# EAGLE design 2016 Vehicle Pedal and Dash Controller manufactured 2016-11-07 (EAGLE 7.7.0)
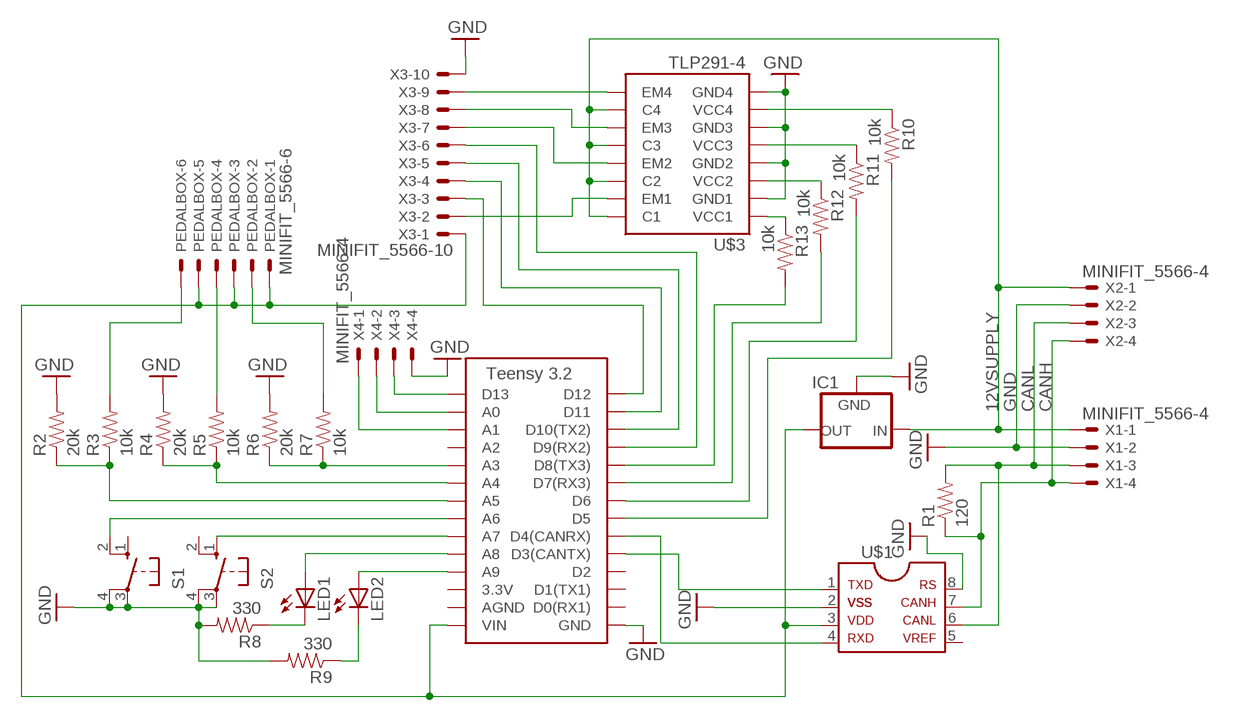
[diagram p0: schematic, sheet 1]

## Parts
IC1  5V_REGULATOR_LM340-NLM340MPX-5.0/NOPB  [SOT223]
LED1  LED-0805  [LED-805]
LED2  LED-0805  [LED-805]
PEDALBOX  MINIFIT_5566-6  [MINIFIT_5566-6]
R1  120  RESISTOR0805-RES  [0805]
R2  20k  RESISTOR0805-RES  [0805]
R3  10k  RESISTOR0805-RES  [0805]
R4  20k  RESISTOR0805-RES  [0805]
R5  10k  RESISTOR0805-RES  [0805]
R6  20k  RESISTOR0805-RES  [0805]
R7  10k  RESISTOR0805-RES  [0805]
R8  330  RESISTOR0805-RES  [0805]
R9  330  RESISTOR0805-RES  [0805]
R10  10k  RESISTOR0805-RES  [0805]
R11  10k  RESISTOR0805-RES  [0805]
R12  10k  RESISTOR0805-RES  [0805]
R13  10k  RESISTOR0805-RES  [0805]
S1  BTN_10-XX  [B3F-10XX]
S2  BTN_10-XX  [B3F-10XX]
U$1  MCP2551DIL  [DIL08]
U$2  TEENSY_3.2_SIMPLE  [TEENSY_3.2_SIMPLE]
U$3  TLP291-4  [SOIC-16]
X1  MINIFIT_5566-4  [MINIFIT_5566-4]
X2  MINIFIT_5566-4  [MINIFIT_5566-4]
X3  MINIFIT_5566-10  [MINIFIT_5566-10]
X4  MINIFIT_5566-4  [MINIFIT_5566-4]

## Nets
12VSUPPLY: IC1.1(IN) U$3.10(C4) U$3.12(C3) U$3.14(C2) U$3.16(C1) X1.1 X2.1
CANH: R1.1 U$1.7 X1.4 X2.4
CANL: R1.2 U$1.6 X1.3 X2.3
GND: IC1.2(GND) IC1.4(GND) R2.2 R4.2 R6.2 R8.2 R9.2 S1.3(P) S1.4(P1) S2.3(P) S2.4(P1) U$1.2 U$1.8 U$2.GND U$3.2(GND1) U$3.4(GND2) U$3.6(GND3) U$3.8(GND4) X1.2 X2.2 X3.10 X4.4
N$1: U$2.D12 X3.3
N$2: IC1.3(OUT) PEDALBOX.1 PEDALBOX.3 PEDALBOX.5 U$1.3 U$2.VIN X3.1
N$3: PEDALBOX.6 R3.2
N$4: PEDALBOX.4 R5.2
N$5: U$1.1 U$2.D3(CANTX)
N$6: U$1.4 U$2.D4(CANRX)
N$7: PEDALBOX.2 R7.2
N$8: R2.1 R3.1 U$2.A5
N$9: R4.1 R5.1 U$2.A4
N$10: R6.1 R7.1 U$2.A3
N$11: U$2.D11 X3.4
N$12: U$2.D10(TX2) X3.5
N$13: U$2.D9(RX2) X3.6
N$14: R13.2 U$2.D8(TX3)
N$15: U$3.9(EM4) X3.9
N$16: U$3.11(EM3) X3.8
N$17: U$3.13(EM2) X3.7
N$18: U$3.15(EM1) X3.2
N$19: R12.2 U$2.D7(RX3)
N$20: R11.2 U$2.D6
N$21: R10.2 U$2.D5
N$22: S1.2(S1) U$2.A6
N$23: S2.1(S) U$2.A7
N$24: LED1.A U$2.A8
N$25: LED2.A U$2.A9
N$26: LED1.C R8.1
N$27: LED2.C R9.1
N$28: U$2.D13 X4.3
N$29: U$2.A0 X4.2
N$30: U$2.A1 X4.1
N$31: R11.1 U$3.5(VCC3)
N$32: R12.1 U$3.3(VCC2)
N$33: R13.1 U$3.1(VCC1)
N$34: R10.1 U$3.7(VCC4)
Unconnected: S1.1(S) S2.2(S1) U$1.5 U$2.3.3V U$2.A2 U$2.AGND U$2.D0(RX1) U$2.D1(TX1) U$2.D2

## Library data of the parts
IC1 = HyTechDevices:5V_REGULATOR_LM340-N: Voltage Regulator 5v linear voltage regulator Datasheet <http://www.mouser.com/ProductDetail/Texas-Instruments/LM340MPX-50-NOPB/?qs=X1J7HmVL2ZGZwtTFRQ9ItA%3D%3D> MAX current out: 1.5A MAX voltage in: 35V
LED1 LED2 = HyTechDevices:LED: Light Emitting Diode Source: Dangerous Prototypes Eagle Library <https://github.com/DangerousPrototypes/Eagle_Part_Library>
PEDALBOX = HyTechDevices:MINIFIT_5566-6: Mini FIT Junior connector 6 pole Source: http://www.molex.com; MPN: 95566-61002; OC_FARNELL: unknown; OC_NEWARK: 22K8620
R1-R13 = HyTechDevices:RESISTOR: Resistor Basic schematic elements and footprints for 0603, 1206, and PTH resistors.
S1 S2 = HyTechDevices:BTN_10-XX: OMRON SWITCH; MPN: B3F-1000; OC_FARNELL: 176432; OC_NEWARK: 36M3542
U$1 = HyTechDevices:MCP2551: MCP2551 High-Speed CAN Transceiver Product Webpage <https://www.microchip.com/wwwproducts/en/MCP2551> Datasheet <http://ww1.microchip.com/downloads/en/DeviceDoc/21667f.pdf> This device is outdated It is replaced by MCP2561. Comparison Page <https://www.microchip.com/wwwproducts/ProductCompare/MCP2551/MCP2561> Product Webpage <https://www.microchip.com/wwwproducts/en/MCP2561> Datasheet <http://ww1.microchip.com/downloads/en/DeviceDoc/20005167C.pdf>
U$2 = HyTechDevices:TEENSY_3.2_SIMPLE: Simple version of the Teensy 3.2 board that only uses the 2 main rows of pins, not the inner pins or the pins opposite the usb port.
U$3 = HyTechDevices:TLP291-4: Toshiba Quad Channel Optocoupler TLP291-4
X1 X2 X4 = HyTechDevices:MINIFIT_5566-4: Mini FIT Junior connector 4 pole Source: http://www.molex.com; OC_FARNELL: unknown; OC_NEWARK: unknown
X3 = HyTechDevices:MINIFIT_5566-10: Mini FIT Junior connector 10 pole Source: http://www.molex.com; OC_FARNELL: unknown; OC_NEWARK: unknown

## Board
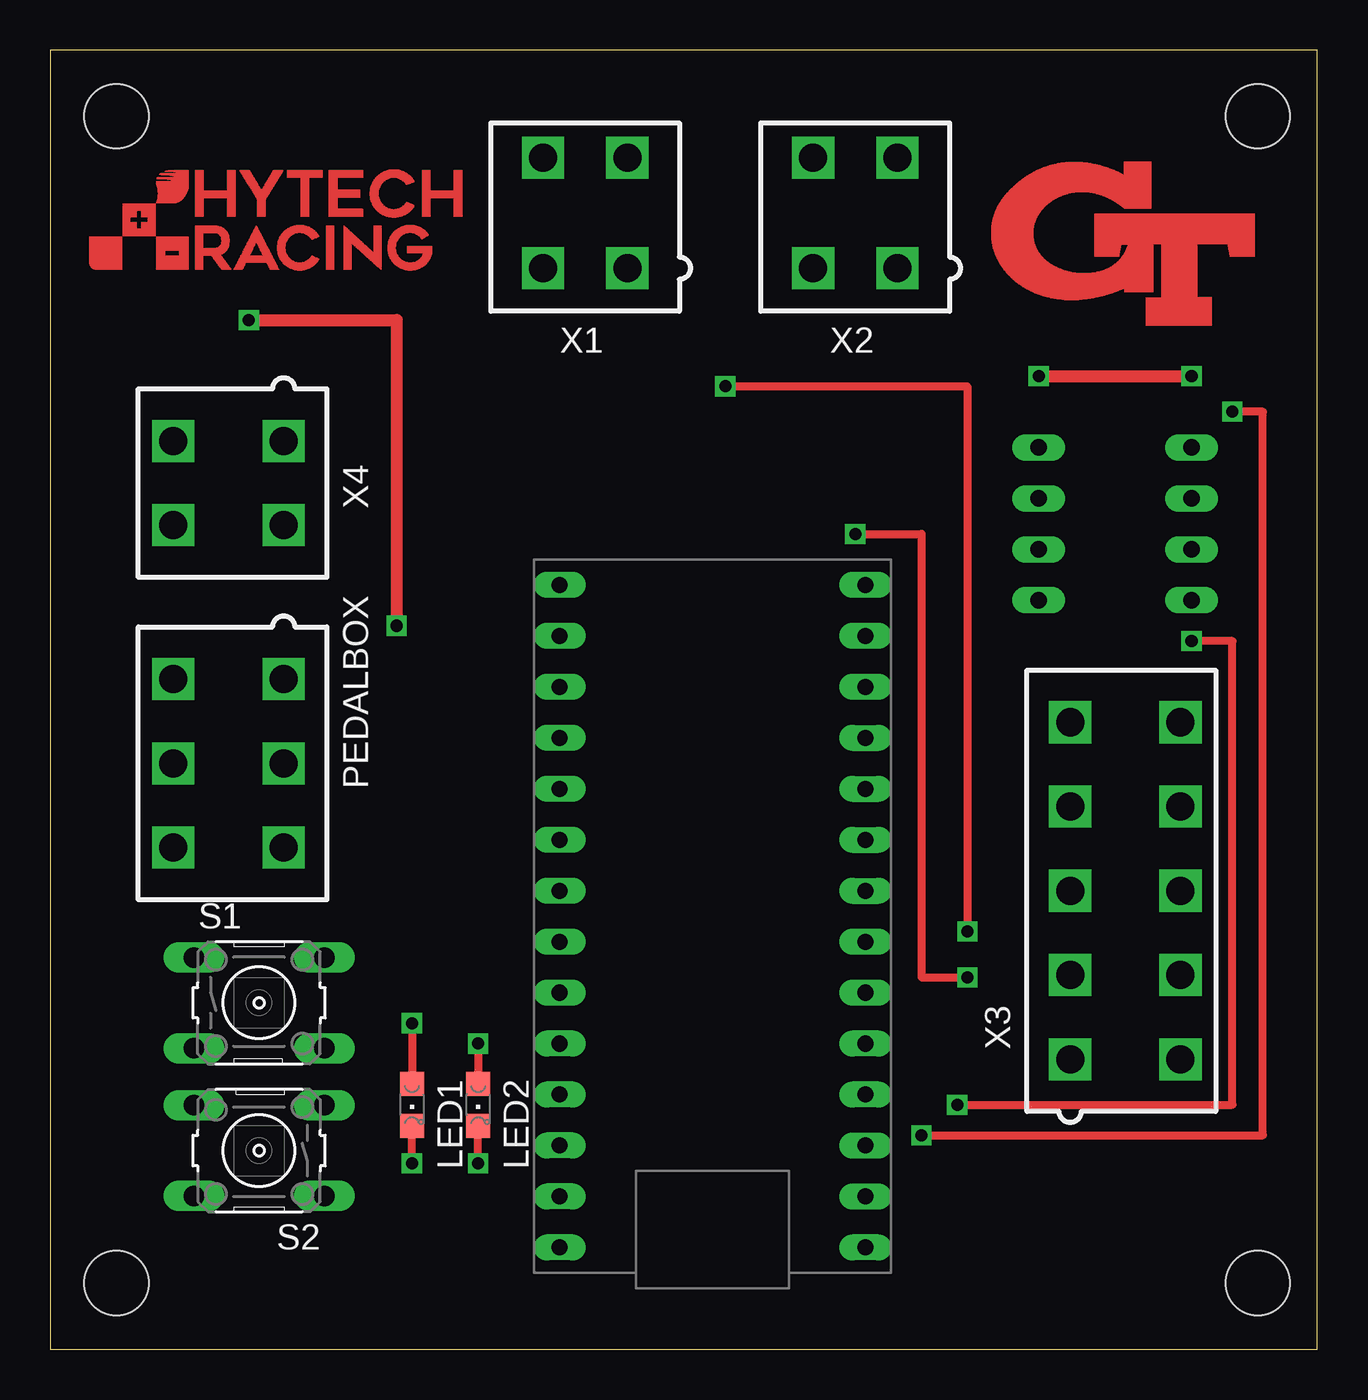
[diagram p1: board, top side]
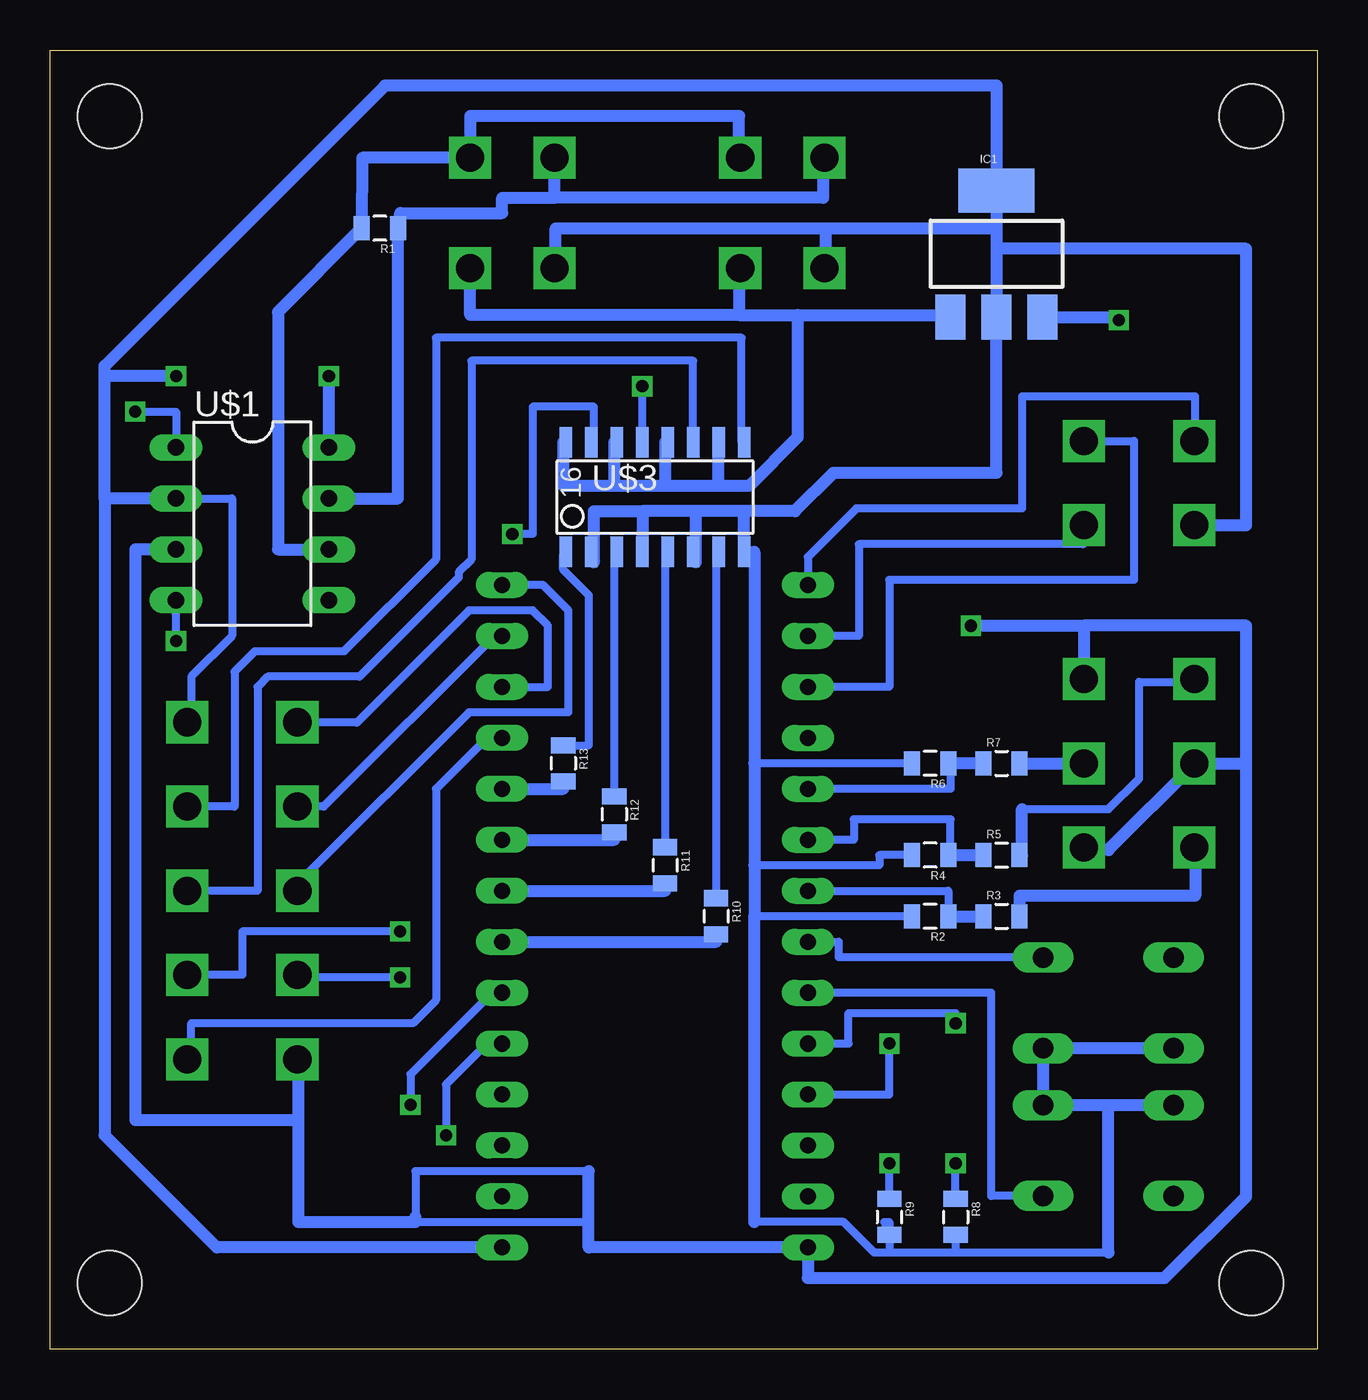
[diagram p2: board, bottom side, seen from below]

Size 63.17 x 64.76 mm. Coordinates in mm from the lower left corner, seen from the top.
Outline: 0,0 63.17,0 63.17,64.76 0,64.76 0,0
Copper layers (1*16): Top 0.035mm / dielectric 1.5mm / Bottom 0.035mm
Design rules "default": minimum track width 10mil, minimum drill 24mil, track to track 8mil, track to pad 8mil, pad to pad 8mil, via to via 8mil, smd to smd 8mil, copper to edge 40mil, drill to drill 8mil, minimum pad ring 10mil, minimum via ring 8mil, stop-mask expansion 4mil, vias tented up to drill 0mil, thermal gap 10mil
Holes 3.2 mm at 3.3,61.47 60.2,61.47 60.2,3.3 3.3,3.3

### Footprints (pad centres in the part's own frame; a part is rotated, then mirrored left to right if it is on the bottom)
SOT223 = smd 1.5 x 2.235: 1 -2.3,-3.15; 2 0,-3.15; 3 2.3,-3.15 | smd 3.8 x 2.2: 4 0,3.15
LED-805 = smd 1.2 x 1.2: A 0,-1.05; C 0,1.05
MINIFIT_5566-6 = drill 1.4 square: 1 4.2,-2.75; 2 0,-2.75; 3 -4.2,-2.75; 4 4.2,2.75; 5 0,2.75; 6 -4.2,2.75
0805 = smd 0.8 x 1.2: 1 -0.9,0; 2 0.9,0
B3F-10XX = drill 1.016 long: 1 -3.251,2.261; 2 3.251,2.261; 3 -3.251,-2.261; 4 3.251,-2.261
DIL08 = drill 0.813 long: 1 -3.81,-3.81; 2 -1.27,-3.81; 3 1.27,-3.81; 4 3.81,-3.81; 5 3.81,3.81; 6 1.27,3.81; 7 -1.27,3.81; 8 -3.81,3.81
TEENSY_3.2_SIMPLE = drill 0.8 long: 3.3V 16.51,29.21; A0 16.51,3.81; A1 16.51,6.35; A2 16.51,8.89; A3 16.51,11.43; A4 16.51,13.97; A5 16.51,16.51; A6 16.51,19.05; A7 16.51,21.59; A8 16.51,24.13; A9 16.51,26.67; AGND 16.51,31.75; D0(RX1) 1.27,31.75; D1(TX1) 1.27,29.21; D2 1.27,26.67; D3(CANTX) 1.27,24.13; D4(CANRX) 1.27,21.59; D5 1.27,19.05; D6 1.27,16.51; D7(RX3) 1.27,13.97; D8(TX3) 1.27,11.43; D9(RX2) 1.27,8.89; D10(TX2) 1.27,6.35; D11 1.27,3.81; D12 1.27,1.27; D13 16.51,1.27; GND 1.27,34.29; VIN 16.51,34.29
SOIC-16 = smd 0.61 x 1.524: 1 -4.445,-2.794; 2 -3.175,-2.794; 3 -1.905,-2.794; 4 -0.635,-2.794; 5 0.635,-2.794; 6 1.905,-2.794; 7 3.175,-2.794; 8 4.445,-2.794; 9 4.445,2.667; 10 3.175,2.667; 11 1.905,2.667; 12 0.635,2.667; 13 -0.635,2.667; 14 -1.905,2.667; 15 -3.175,2.667; 16 -4.445,2.667
MINIFIT_5566-4 = drill 1.4 square: 1 2.1,-2.75; 2 -2.1,-2.75; 3 2.1,2.75; 4 -2.1,2.75
MINIFIT_5566-10 = drill 1.4 square: 1 8.4,-2.75; 2 4.2,-2.75; 3 0,-2.75; 4 -4.2,-2.75; 5 -8.4,-2.75; 6 8.4,2.75; 7 4.2,2.75; 8 0,2.75; 9 -4.2,2.75; 10 -8.4,2.75

### Placement (x,y rotation side)
IC1  16,54.61 0 bottom
LED1  18.03,12.19 180 top
LED2  21.34,12.19 180 top
PEDALBOX  8.89,29.21 90 top
R1  46.74,55.88 180 bottom
R2  19.3,21.59 180 bottom
R3  15.75,21.59 0 bottom
R4  19.3,24.64 180 bottom
R5  15.75,24.64 0 bottom
R6  19.3,29.21 180 bottom
R7  15.75,29.21 0 bottom
R8  18.03,6.6 270 bottom
R9  21.34,6.6 270 bottom
R10  29.97,21.59 270 bottom
R11  32.51,24.13 270 bottom
R12  35.05,26.67 270 bottom
R13  37.59,29.21 270 bottom
S1  10.41,17.27 0 top
S2  10.41,9.91 180 top
U$1  53.09,41.15 270 bottom
U$2  41.91,39.37 180 top
U$3  33.02,42.55 0 bottom
X1  26.67,56.64 0 top
X2  40.13,56.64 0 top
X3  53.59,22.86 270 top
X4  8.89,43.18 90 top

### Tracks (layer width: path | path; a pad name or v marks a point on that pad's centre or on a via)
12VSUPPLY
  Bottom 0.61: X1.1 28.83,53.89 28.83,51.56 | 28.83,51.56 42.23,51.56 X2.1 | 28.83,51.56 25.91,51.56 | 25.91,51.56 25.91,45.47 28.32,43.05 29.85,43.05 | 29.85,43.05 U$3.10 | U$3.12 32.51,45.21 32.51,43.05 | 32.51,43.05 29.85,43.05 | U$3.14 35.05,45.21 35.05,43.05 | 35.05,43.05 32.51,43.05 | U$3.16 37.59,45.21 37.59,43.05 35.05,43.05 | 25.91,51.56 18.3,51.56 IC1.1
CANH
  Bottom 0.61: X1.4 24.64,59.39 24.64,57.4 38.03,57.4 | 38.03,57.4 X2.4 | 38.03,57.4 40.64,57.4 40.64,56.64 45.72,56.64 45.72,55.88 R1.1 45.84,42.42 U$1.7
CANL
  Bottom 0.61: X1.3 28.83,59.39 28.83,61.47 42.23,61.47 X2.3 47.61,59.39 R1.2 51.82,51.7 51.82,39.88 U$1.6
GND  (via drill 0.6)
  Top 0.61: v49.28,48.51 v56.9,48.51
  Bottom 0.406: R6.2 28.07,29.21 | R4.2 21.84,24.64 21.84,24.13 28.07,24.13 | R2.2 28.07,21.59 | R9.2 21.59,6.35 21.34,6.35 R9.2 | 21.34,4.83 22.1,4.83 23.62,6.35 28.07,6.35 | 21.34,4.83 18.03,4.83 | 18.03,4.83 10.41,4.83 | R8.2 18.03,4.83 | R9.2 21.34,4.83 | U$1.2 54.1,42.42 54.1,35.56 56.13,33.53 56.13,31.47 X3.10
  Bottom 0.61: U$3.2 36.07,39.24 36.07,41.78 33.65,41.78 | 33.65,41.78 U$3.4 | U$3.6 30.99,39.24 30.99,41.78 | 30.99,41.78 33.65,41.78 | 28.57,41.78 U$3.8 28.07,39.75 28.07,29.21 28.07,24.13 28.07,21.59 28.07,6.35 | 28.57,41.78 30.99,41.78 | 16,55.88 IC1.4 16,62.99 46.48,62.99 60.45,49.02 60.45,48.51 | 16,55.88 16,54.86 | 16,54.86 IC1.2 16,43.69 24.13,43.69 26.04,41.78 28.57,41.78 | X1.2 24.51,53.89 24.51,55.88 | X4.4 3.56,41.08 3.56,54.86 16,54.86 | X2.2 37.97,53.89 37.97,55.88 24.51,55.88 | S2.4 10.41,12.17 | 10.41,12.17 S2.3 S1.4 S1.3 | U$1.2 60.45,42.42 | 60.45,42.42 60.45,48.51 | U$1.8 v49.28,48.51 | 10.41,4.83 10.41,12.17 | U$2.GND 54.86,5.08 60.45,10.67 60.45,42.42 | 24.51,55.88 16,55.88 | v56.9,48.51 60.45,48.51
N$1
  Bottom 0.406: U$2.D12 38.61,38.1 37.34,36.83 37.34,31.75 42.29,31.75 50.67,23.37 50.67,23.03 X3.3
N$2  (via drill 0.6)
  Top 0.61: v9.91,51.31 17.27,51.31 v17.27,36.07
  Bottom 0.406: 44.96,6.35 36.32,6.35 | 44.96,6.6 44.96,8.89 36.32,8.89
  Bottom 0.61: X3.1 50.8,14.46 50.8,11.43 | 50.8,11.43 50.8,6.35 44.96,6.35 44.96,6.6 | IC1.3 9.91,51.46 v9.91,51.31 | v17.27,36.07 11.64,36.07 | 11.64,36.07 PEDALBOX.1 | 3.56,29.21 PEDALBOX.5 6.14,29.17 10.41,24.89 11.52,24.89 PEDALBOX.3 | 3.56,29.21 3.56,36.07 11.64,36.07 | U$1.3 58.93,39.88 58.93,11.43 50.8,11.43 | 3.56,29.21 3.56,7.62 7.62,3.56 25.4,3.56 U$2.VIN 36.32,5.08 36.32,8.89
N$3
  Bottom 0.61: PEDALBOX.6 6.1,25.01 6.1,22.61 14.85,22.61 R3.2
N$4
  Bottom 0.406: 14.73,26.92 10.41,26.92 8.89,28.45 8.89,33.27 6.28,33.27 PEDALBOX.4
  Bottom 0.61: R5.2 14.73,24.64 14.73,26.92
N$5  (via drill 0.6)
  Top 0.406: v43.43,10.67 60.45,10.67 60.45,46.74 v58.93,46.74
  Bottom 0.406: U$2.D3(CANTX) 41.4,15.24 43.43,13.21 v43.43,10.67 | v58.93,46.74 56.9,46.74 U$1.1
N$6  (via drill 0.6)
  Top 0.406: v45.21,12.19 58.93,12.19 58.93,35.31 v56.9,35.31
  Bottom 0.406: U$2.D4(CANRX) 41.15,17.78 45.21,13.72 v45.21,12.19 | v56.9,35.31 U$1.4
N$7
  Bottom 0.61: R7.2 PEDALBOX.2
N$8
  Bottom 0.406: U$2.A5 18.4,22.86 R2.1
  Bottom 0.61: R2.1 R3.1
N$9
  Bottom 0.406: R4.1 18.29,24.64 18.29,26.42 23.11,26.42 23.11,25.4 U$2.A4
  Bottom 0.61: 18.29,24.64 R5.1
N$10
  Bottom 0.406: R6.1 18.29,29.21 18.29,27.94 U$2.A3
  Bottom 0.61: R7.1 R6.1
N$11
  Bottom 0.406: U$2.D11 41.02,35.56 49.53,27.05 X3.4
N$12
  Bottom 0.406: U$2.D10(TX2) 38.35,33.02 38.35,36.07 39.12,36.83 42.29,36.83 47.88,31.24 50.83,31.24 X3.5
N$13
  Bottom 0.406: X3.6 56.13,14.46 56.13,16.26 45.09,16.26 43.94,17.4 43.94,27.94 41.4,30.48 U$2.D9(RX2)
N$14
  Bottom 0.61: U$2.D8(TX3) 37.59,27.94 R13.2
N$15
  Bottom 0.406: U$3.9 28.7,45.21 28.7,50.42 43.94,50.42 43.94,39.37 48.51,34.8 52.96,34.8 53.98,33.78 53.98,27.06 X3.9
N$16
  Bottom 0.406: U$3.11 31.12,49.28 42.16,49.28 42.16,39.37 42.8,38.73 42.8,38.48 47.75,33.53 52.32,33.53 52.83,33.02 52.83,22.86 X3.8
N$17  (via drill 0.6)
  Top 0.406: v33.65,48.01 45.72,48.01 v45.72,20.83
  Bottom 0.406: U$3.13 v33.65,48.01 | v45.72,20.83 53.59,20.83 53.59,18.67 X3.7
N$18  (via drill 0.6)
  Top 0.406: v40.13,40.64 43.43,40.64 43.43,18.54 v45.72,18.54
  Bottom 0.406: U$3.15 36.07,45.21 36.07,46.99 39.12,46.99 39.12,40.64 v40.13,40.64 | v45.72,18.54 50.84,18.54 X3.2
N$19
  Bottom 0.61: U$2.D7(RX3) 35.05,25.4 R12.2
N$20
  Bottom 0.61: U$2.D6 32.51,22.86 R11.2
N$21
  Bottom 0.61: U$2.D5 29.97,20.32 R10.2
N$22
  Bottom 0.406: U$2.A6 23.88,20.32 23.88,19.56 13.66,19.56 S1.2
N$23
  Bottom 0.406: S2.1 16.26,7.64 16.26,17.78 U$2.A7
N$24  (via drill 0.6)
  Top 0.406: v18.03,16.26 LED1.A
  Bottom 0.406: U$2.A8 23.37,15.24 23.37,16.76 18.03,16.76 v18.03,16.26
N$25  (via drill 0.6)
  Top 0.406: v21.34,15.24 LED2.A
  Bottom 0.406: U$2.A9 21.34,12.7 v21.34,15.24
N$26  (via drill 0.6)
  Top 0.406: v18.03,9.27 LED1.C
  Bottom 0.406: R8.1 v18.03,9.27
N$27  (via drill 0.6)
  Top 0.406: v21.34,9.27 LED2.C
  Bottom 0.406: R9.1 v21.34,9.27
N$28
  Bottom 0.406: X4.3 6.1,45.28 6.1,47.5 14.73,47.5 14.73,41.91 22.99,41.91 25.4,39.5 U$2.D13
N$29
  Bottom 0.406: U$2.A0 22.86,35.56 22.86,40.13 11.68,40.13 11.68,41.08 X4.2
N$30
  Bottom 0.406: X4.1 9.14,45.28 9.14,38.35 21.34,38.35 21.34,33.02 U$2.A1
N$31
  Bottom 0.406: U$3.5 32.51,39.24 R11.1
N$32
  Bottom 0.406: U$3.3 35.05,39.24 R12.1
N$33
  Bottom 0.406: R13.1 36.32,30.11 36.32,37.59 37.59,38.86 37.59,39.62 U$3.1
N$34
  Bottom 0.406: U$3.7 29.97,39.24 R10.1
  Bottom 0.61: R10.1 29.85,22.49
(copper drawn outside any net)
  shapes: Top area x3696